# EAGLE design Crumar_D9U_Drawbars (EAGLE 6.4)
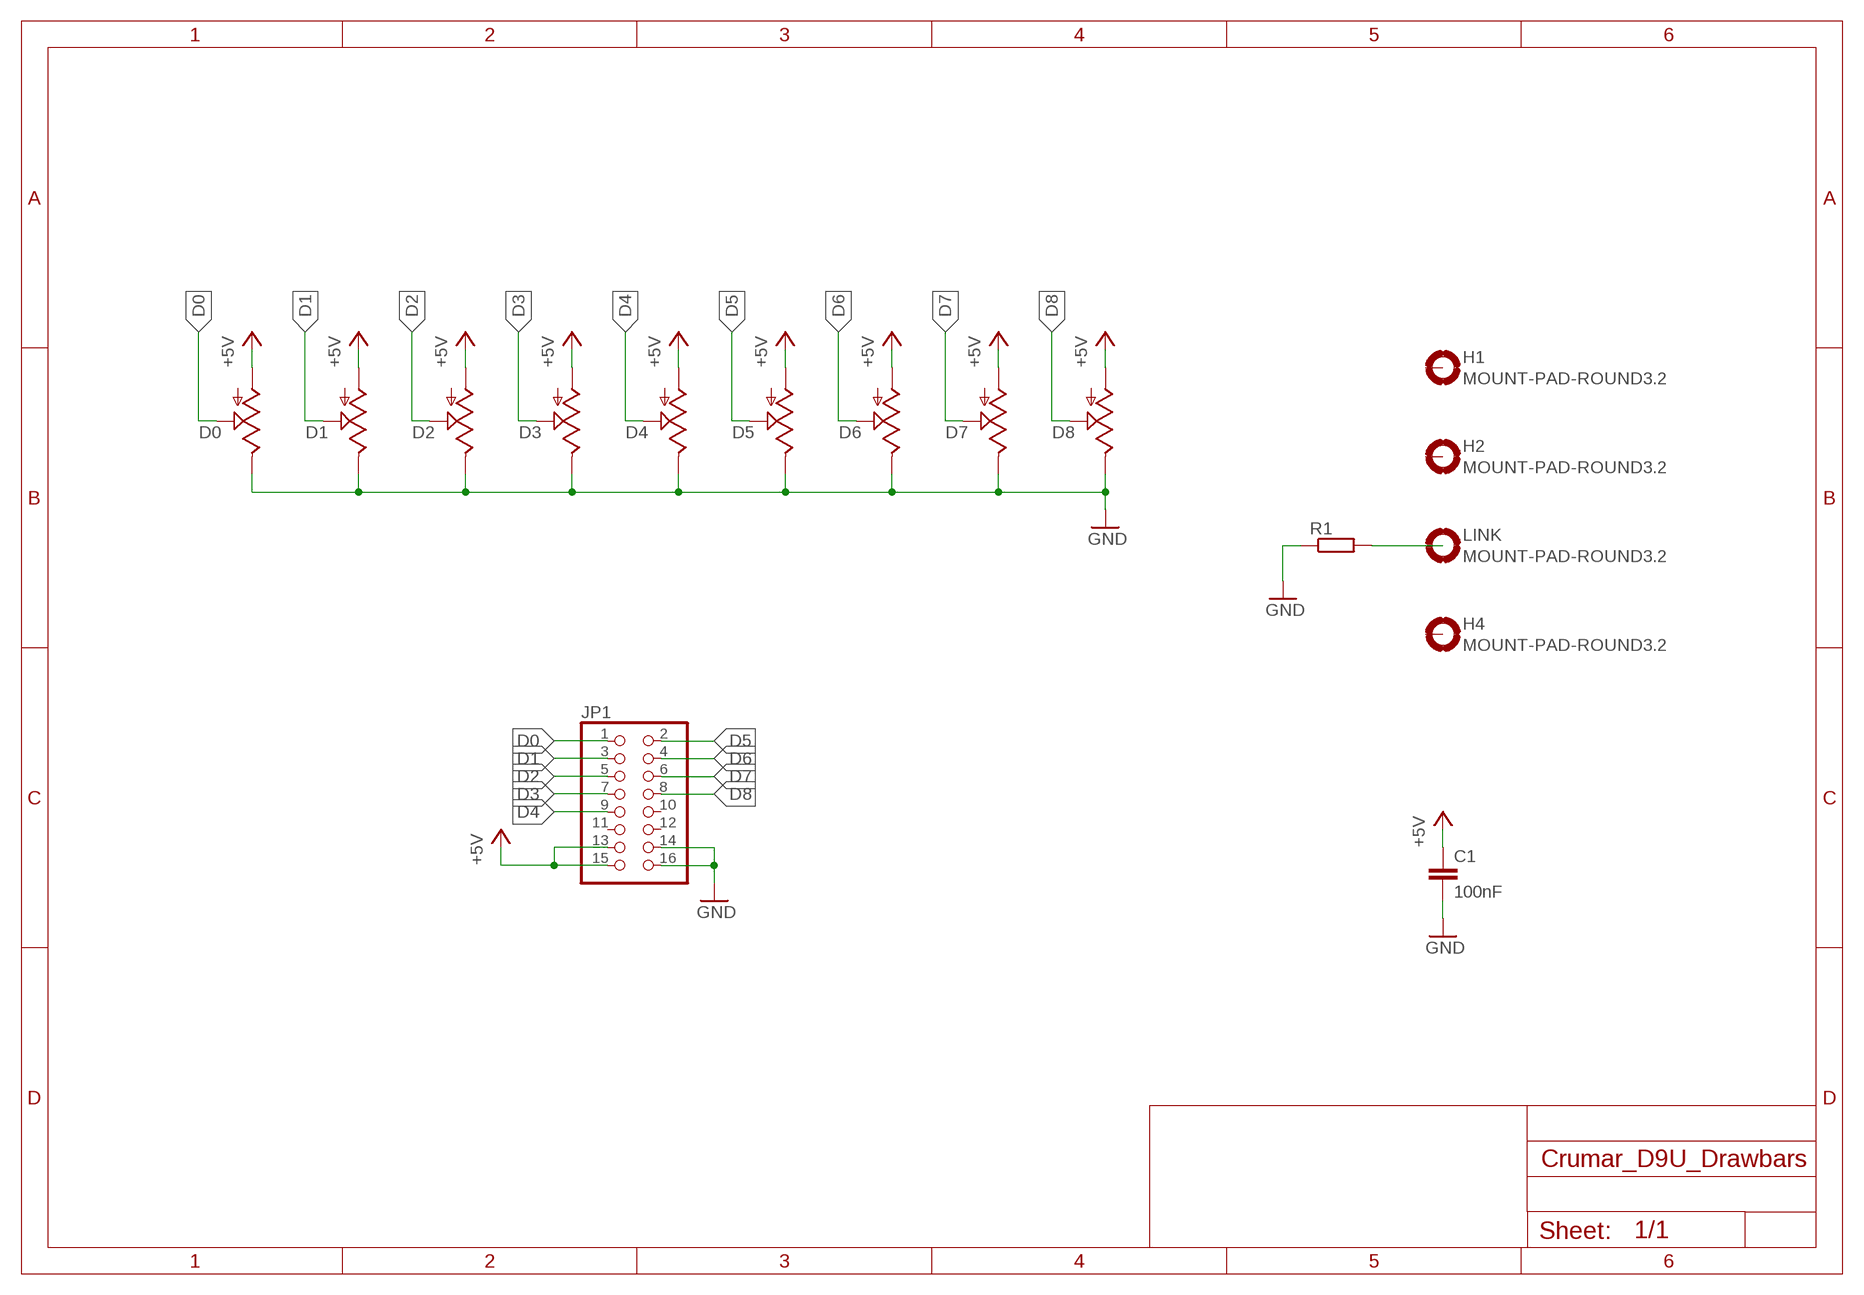
[diagram p0: schematic, sheet 1]

## Parts
C1  100nF  C-EU050-024X044  [C050-024X044]
D0  POTENTIOMETER  [ALPHA_DRAWBARS]
D1  POTENTIOMETER  [ALPHA_DRAWBARS]
D2  POTENTIOMETER  [ALPHA_DRAWBARS]
D3  POTENTIOMETER  [ALPHA_DRAWBARS]
D4  POTENTIOMETER  [ALPHA_DRAWBARS]
D5  POTENTIOMETER  [ALPHA_DRAWBARS]
D6  POTENTIOMETER  [ALPHA_DRAWBARS]
D7  POTENTIOMETER  [ALPHA_DRAWBARS]
D8  POTENTIOMETER  [ALPHA_DRAWBARS]
H1  MOUNT-PAD-ROUND3.2  [3,2-PAD]
H2  MOUNT-PAD-ROUND3.2  [3,2-PAD]
H4  MOUNT-PAD-ROUND3.2  [3,2-PAD]
JP1  PINHD-2X8  [2X08]
LINK  MOUNT-PAD-ROUND3.2  [3,2-PAD]
R1  R-EU_0207/12  [0207/12]

## Nets
+5V [+5]: C1.1 D0.P$2 D1.P$2 D2.P$2 D3.P$2 D4.P$2 D5.P$2 D6.P$2 D7.P$2 D8.P$2 JP1.13 JP1.15
D0: D0.P$3 JP1.1
D1: D1.P$3 JP1.3
D2: D2.P$3 JP1.5
D3: D3.P$3 JP1.7
D4: D4.P$3 JP1.9
D5: D5.P$3 JP1.2
D6: D6.P$3 JP1.4
D7: D7.P$3 JP1.6
D8: D8.P$3 JP1.8
GND [GND]: C1.2 D0.P$1 D1.P$1 D2.P$1 D3.P$1 D4.P$1 D5.P$1 D6.P$1 D7.P$1 D8.P$1 JP1.14 JP1.16 R1.1
LINK: R1.2
Unconnected: H1.B3,2(MOUNT) H2.B3,2(MOUNT) H4.B3,2(MOUNT) JP1.10 JP1.11 JP1.12 LINK.B3,2(MOUNT)

## Library data of the parts
C1 = rcl:C-EU: CAPACITOR, European symbol
D0 D1-D8 = Potentiometers:POTENTIOMETER: Potentiometer
H1 H2 H4 LINK = holes:MOUNT-PAD-ROUND: MOUNTING PAD, round
JP1 = pinhead:PINHD-2X8: PIN HEADER
R1 = rcl:R-EU_: RESISTOR, European symbol

## Net classes
0 default: width 0.254 mm, drill 0.152 mm, clearance 0.254 mm
1 +5: width 0.508 mm, drill 0.152 mm, clearance 0.406 mm
2 GND: width 1.016 mm, drill 0.152 mm, clearance 1.016 mm

## Board
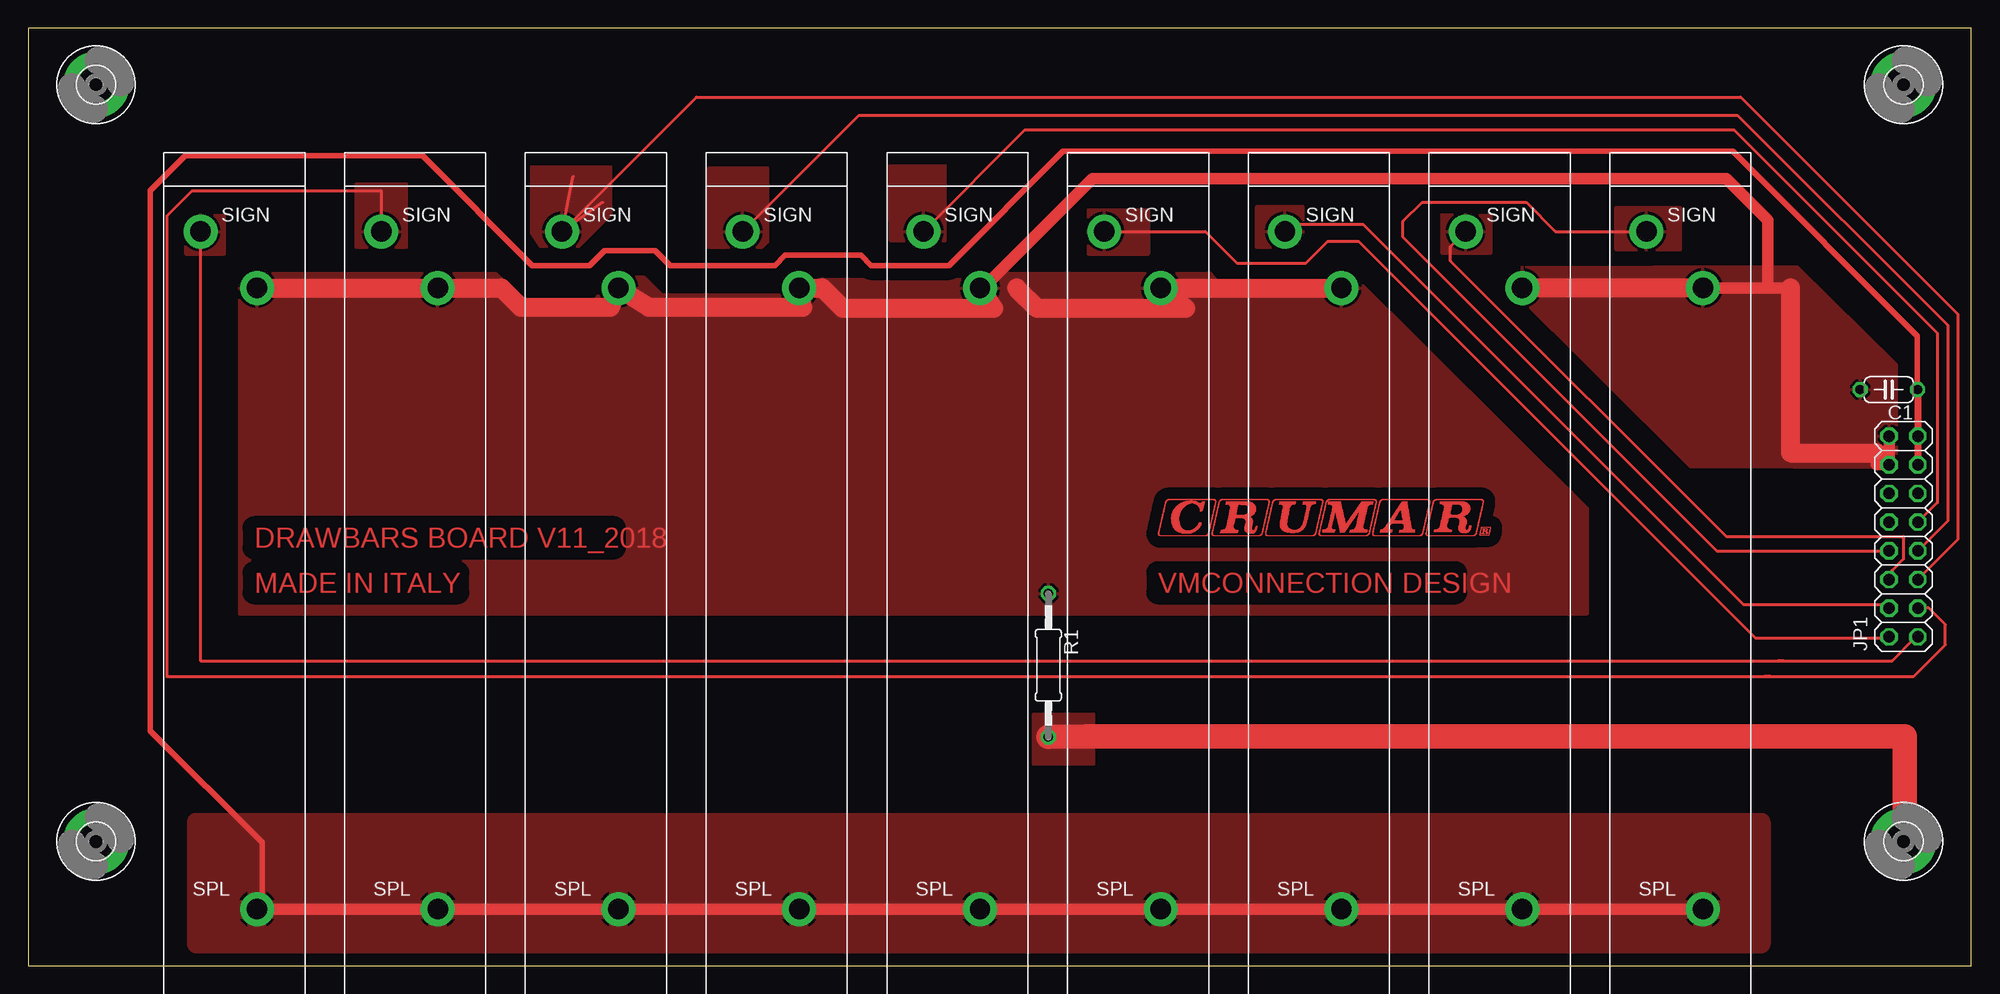
[diagram p1: board, top side]

Size 172 x 83 mm. Coordinates in mm from the lower left corner, seen from the top.
Outline: 0,0 172,0 172,83 0,83 0,0
Copper layers (1*16): Top 0.035mm / dielectric 1.5mm / Bottom 0.035mm
Design rules "default": minimum track width 10mil, minimum drill 24mil, track to track 8mil, track to pad 8mil, pad to pad 8mil, via to via 8mil, smd to smd 8mil, copper to edge 40mil, drill to drill 8mil, minimum pad ring 10mil, minimum via ring 8mil, stop-mask expansion 4mil, vias tented up to drill 0mil, thermal gap 10mil

### Footprints (pad centres in the part's own frame; a part is rotated, then mirrored left to right if it is on the bottom)
C050-024X044 = drill 0.813 octagon: 1 -2.54,0; 2 2.54,0
ALPHA_DRAWBARS = drill 1.8 pad 3: P$1 8.25,64; P$2 8.25,9; P$3 3.25,69
3,2-PAD = drill 3.2 pad 5.842: B3,2 0,0
2X08 = drill 1.016 octagon: 1 -8.89,-1.27; 2 -8.89,1.27; 3 -6.35,-1.27; 4 -6.35,1.27; 5 -3.81,-1.27; 6 -3.81,1.27; 7 -1.27,-1.27; 8 -1.27,1.27; 9 1.27,-1.27; 10 1.27,1.27; 11 3.81,-1.27; 12 3.81,1.27; 13 6.35,-1.27; 14 6.35,1.27; 15 8.89,-1.27; 16 8.89,1.27
0207/12 = drill 0.813 octagon: 1 -6.35,0; 2 6.35,0

### Placement (x,y rotation side)
C1  164.7,51 180 top
D0  12,-4 0 top
D1  28,-4 0 top
D2  44,-4 0 top
D3  60,-4 0 top
D4  76,-4 0 top
D5  92,-4 0 top
D6  108,-4 0 top
D7  124,-4 0 top
D8  140,-4 0 top
H1  6,11 0 top
H2  6,78 0 top
H4  166,78 0 top
JP1  166,38 90 top
LINK  166,11 0 top
R1  90.3,26.6 270 top
U$1  [CRUMAR3CMTOP]  100,38 0 top

### Tracks (layer width: path | path; a pad name or v marks a point on that pad's centre or on a via)
+5V
  Top 0.508: D0.P$2 20.7,5.45 20.7,10.9 10.8,20.8 10.8,68.6 13.9,71.7 34.9,71.7 44.6,62 49.7,62 51,63.3 55.5,63.3 56.8,62 66.1,62 67,62.9 73.7,62.9 74.6,62 81.5,62 91.6,72.1 150.9,72.1 167.24,55.76 C1.1
  Top 0.61: JP1.13 JP1.15 167.27,50.97 C1.1
  Top 1.016: D8.P$2 D7.P$2 D6.P$2 D5.P$2 D4.P$2 D3.P$2 D2.P$2 D1.P$2 D0.P$2
  pour Top (isolate 0.61): 14.9,12.7 153.4,12.7 153.4,1.9 14.9,1.9
D0
  Top 0.254: JP1.1 167,29 165,27 155.4,27 | 155.4,27 154.9,27 | D0.P$3 15.25,27 155.4,27
  pour Top: 13.9,66.4 13.9,63 17.4,63 17.4,66.4
D1
  Top 0.254: JP1.3 168.25,31.65 169.7,30.2 169.7,28.4 166.9,25.6 154.2,25.6 | 154.2,25.6 153.7,25.6 | D1.P$3 31.25,68.6 14.5,68.6 12.3,66.4 12.3,25.6 154.2,25.6
  pour Top: 29,69.2 29,63.6 33.5,63.6 33.5,69.2
D2
  Top 0.254: D2.P$3 48,65 | JP1.5 170.8,37.72 170.8,57.7 151.6,76.9 59.15,76.9 D2.P$3 | D2.P$3 50.85,67.6 | D2.P$3 48.25,69.9
  pour Top: 44.5,70.7 44.5,64.9 45.3,63.7 48.8,63.7 51.6,66.5 51.6,70.7
D3
  Top 0.254: JP1.7 169.9,39.36 169.9,56.7 151.3,75.3 73.55,75.3 D3.P$3
  pour Top: 60.2,70.6 60.2,63.6 65,63.6 65.5,64.1 65.5,70.6
D4
  Top 0.254: JP1.9 169,41 169,56 151,74 88.25,74 D4.P$3
  pour Top: 76.2,70.8 76.3,64.2 81.2,64.2 81.2,70.8
D5
  Top 0.254: JP1.2 164,29 152.9,29 117.8,64.1 115,64.1 113.1,62.2 107,62.2 104.2,65 D5.P$3
  pour Top: 93.8,66.9 93.8,63 99.2,63 99.2,66.9
D6
  Top 0.254: JP1.4 165,32 151.8,32 118.2,65.6 111.85,65.6 D6.P$3
  pour Top: 108.7,67.2 108.7,63.6 112.9,63.6 112.9,67.2
D7
  Top 0.254: JP1.6 165,34 165,35 166,36 166,38 150.3,38 125.9,62.4 125.9,63.65 D7.P$3
  pour Top: 125.1,66.5 125.1,63.1 129.5,63.1 129.5,66.4
D8
  Top 0.254: JP1.8 149.47,36.73 121.7,64.5 121.7,65.9 123.4,67.6 132.6,67.6 135.2,65 D8.P$3
  pour Top: 140.5,67.1 140.5,63.4 146.3,63.4 146.3,67.1
GND
  Top 1.016: 156,60 D8.P$1 154,60 154,66 150.3,69.7 94.2,69.7 85.3,60.8 85.05,60.8 D4.P$1 | JP1.16 JP1.14 163.6,44.35 163.6,45.4
  Top 1.676: D0.P$1 D1.P$1 41.9,60 43.6,58.3 51.55,58.3 D2.P$1 54.95,58.3 68.55,58.3 D3.P$1 70.3,60 72.1,58.2 85.45,58.2 D4.P$1 | D8.P$1 D7.P$1 | 156,60 156,45.4 163.6,45.4 | D6.P$1 D5.P$1 102.45,58.2 89.3,58.2 87.5,60
  pour Top (isolate 0.61): 18.7,61.3 41.4,61.3 44.5,58.2 49.4,58.2 52,61 54.5,61 56.1,59.4 67.7,59.4 69.1,60.8 85.7,60.8 86.7,61.3 104.7,61.3 105.2,60.7 114.9,60.6 114.9,61.4 117,61.4 138,40.5 138,31.1 18.7,31.1
  pour Top: 131,61.8 131,60.2 147.1,44.2 165.4,44.1 165.4,53.2 156.6,61.9
LINK
  Top 0.61: 156.6,20.4 162.2,20.4 162.3,20.3
  Top 1.778: 156.6,20.4 156.45,20.25
  Top 2.184: 166.1,10.9 166.1,20.3 162.3,20.3 93.65,20.3 R1.2
  pour Top: 89,22.3 94.3,22.3 94.3,17.8 89,17.8

### Text on the board
Top: DRAWBARS BOARD V11_2018 | MADE IN ITALY | VMCONNECTION DESIGN